# EAGLE design Relay-Board_Rack-PDU_1.0 (EAGLE 9.2.1)

## Sheet 1 of 3
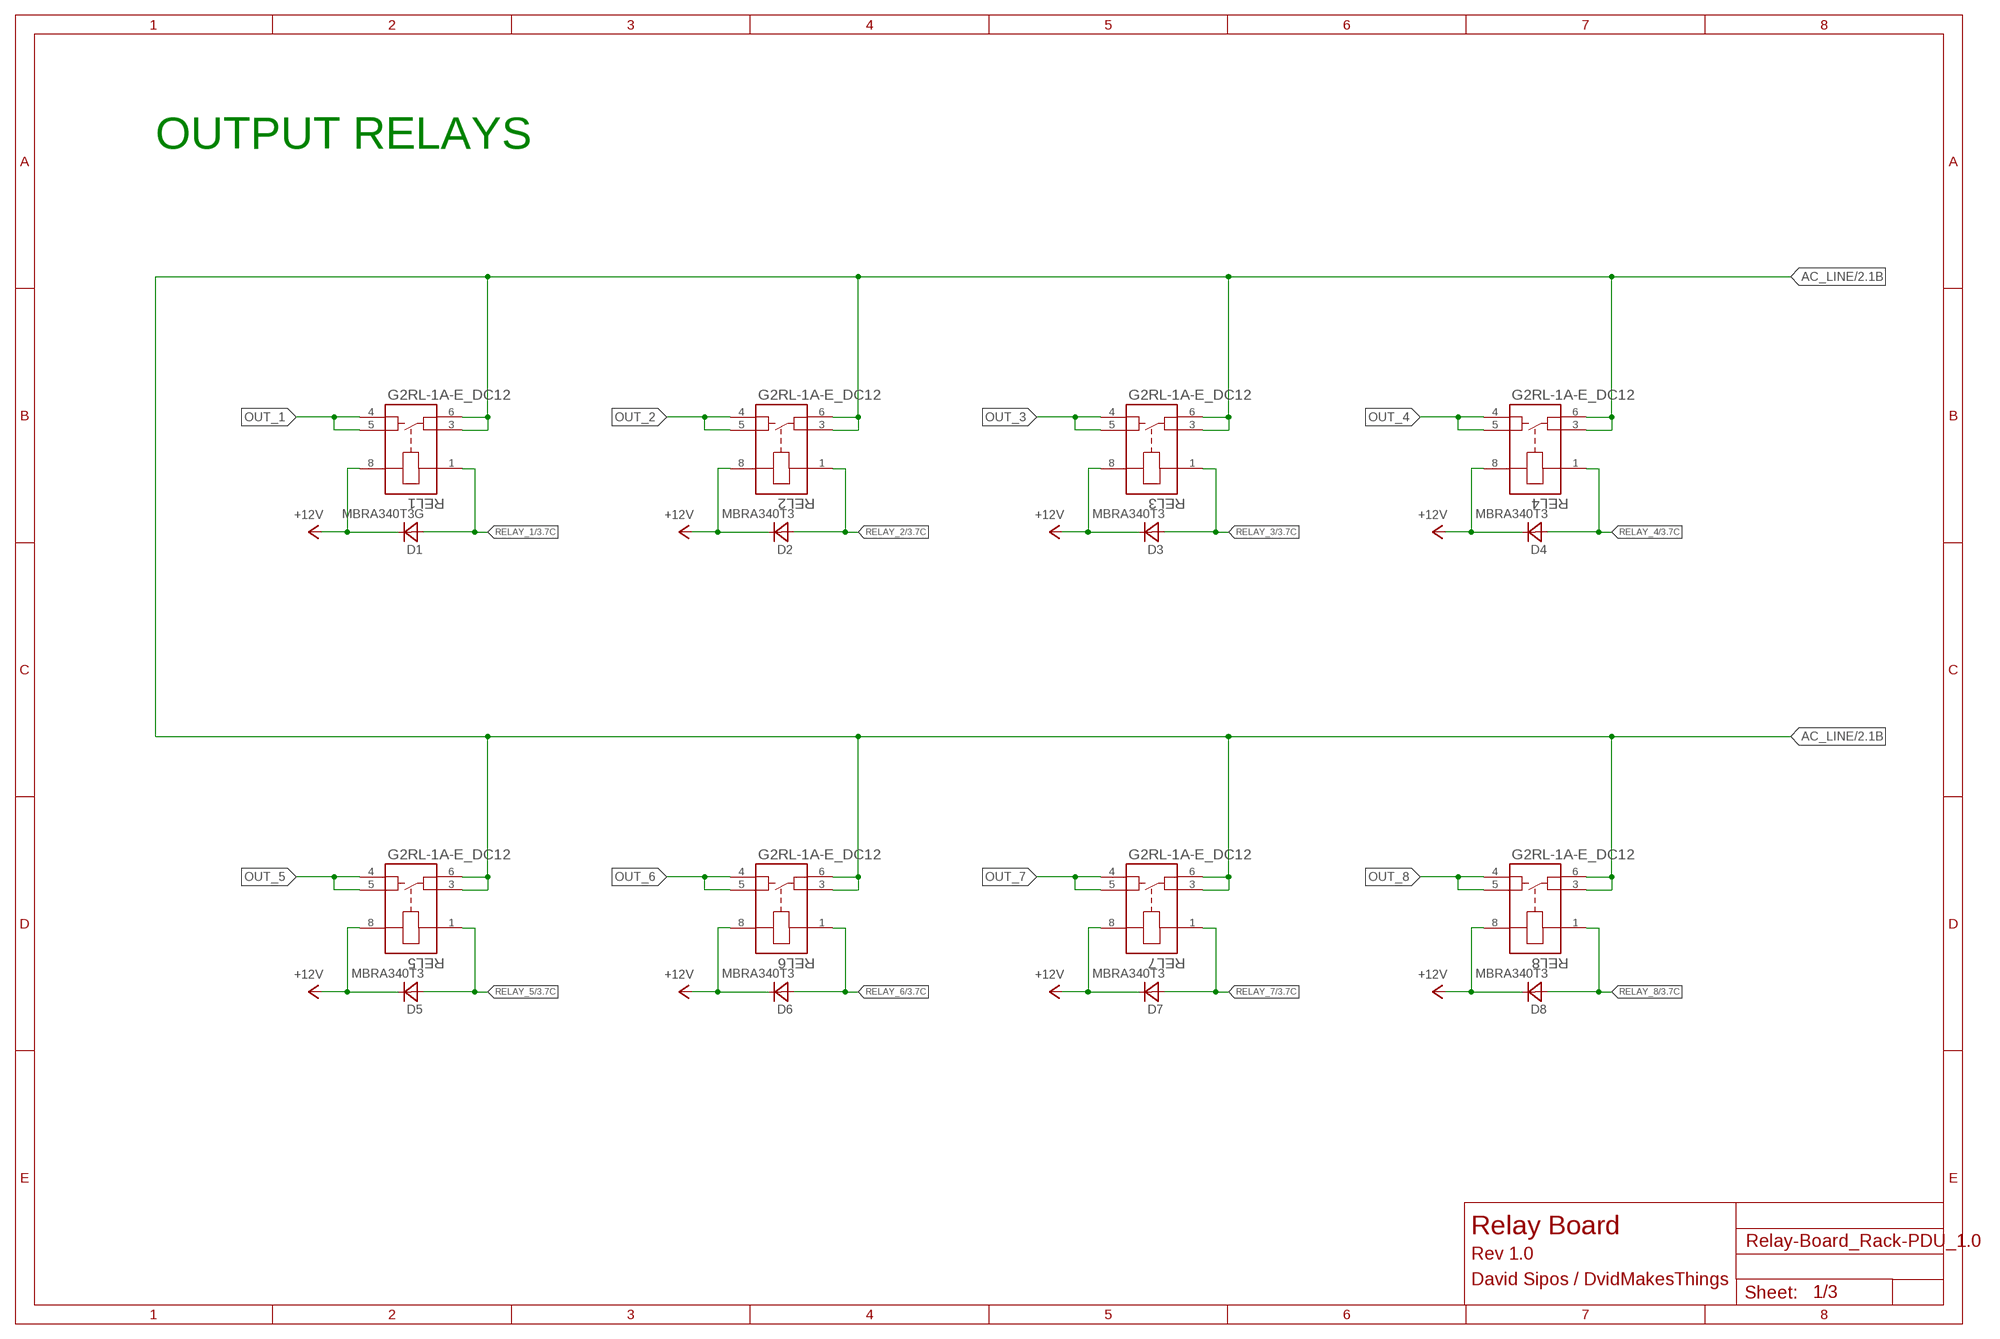
[diagram p0: schematic, sheet 1]

### Parts
D1  MBRA340T3G  MBRA340T3  [SMA]
D2  MBRA340T3  [SMA]
D3  MBRA340T3  [SMA]
D4  MBRA340T3  [SMA]
D5  MBRA340T3  [SMA]
D6  MBRA340T3  [SMA]
D7  MBRA340T3  [SMA]
D8  MBRA340T3  [SMA]
REL1  G2RL-1A-E_DC12  [RELAY_G2RL-1A-E_DC5_OMR]
REL2  G2RL-1A-E_DC12  [RELAY_G2RL-1A-E_DC5_OMR]
REL3  G2RL-1A-E_DC12  [RELAY_G2RL-1A-E_DC5_OMR]
REL4  G2RL-1A-E_DC12  [RELAY_G2RL-1A-E_DC5_OMR]
REL5  G2RL-1A-E_DC12  [RELAY_G2RL-1A-E_DC5_OMR]
REL6  G2RL-1A-E_DC12  [RELAY_G2RL-1A-E_DC5_OMR]
REL7  G2RL-1A-E_DC12  [RELAY_G2RL-1A-E_DC5_OMR]
REL8  G2RL-1A-E_DC12  [RELAY_G2RL-1A-E_DC5_OMR]

### Nets
+12V: D1.C D2.C D3.C D4.C D5.C D6.C D7.C D8.C REL1.8 REL2.8 REL3.8 REL4.8 REL5.8 REL6.8 REL7.8 REL8.8 ; also sheet 2,3
AC_LINE: REL1.3 REL1.6 REL2.3 REL2.6 REL3.3 REL3.6 REL4.3 REL4.6 REL5.3 REL5.6 REL6.3 REL6.6 REL7.3 REL7.6 REL8.3 REL8.6 ; also sheet 2
OUT_1: REL1.4 REL1.5
OUT_2: REL2.4 REL2.5
OUT_3: REL3.4 REL3.5
OUT_4: REL4.4 REL4.5
OUT_5: REL5.4 REL5.5
OUT_6: REL6.4 REL6.5
OUT_7: REL7.4 REL7.5
OUT_8: REL8.4 REL8.5
RELAY_1: D1.A REL1.1 ; also sheet 3
RELAY_2: D2.A REL2.1 ; also sheet 3
RELAY_3: D3.A REL3.1 ; also sheet 3
RELAY_4: D4.A REL4.1 ; also sheet 3
RELAY_5: D5.A REL5.1 ; also sheet 3
RELAY_6: D6.A REL6.1 ; also sheet 3
RELAY_7: D7.A REL7.1 ; also sheet 3
RELAY_8: D8.A REL8.1 ; also sheet 3

### Notes on the sheet
- OUTPUT RELAYS
- Relay Board
- Rev 1.0
- David Sipos / DvidMakesThings

## Sheet 2 of 3
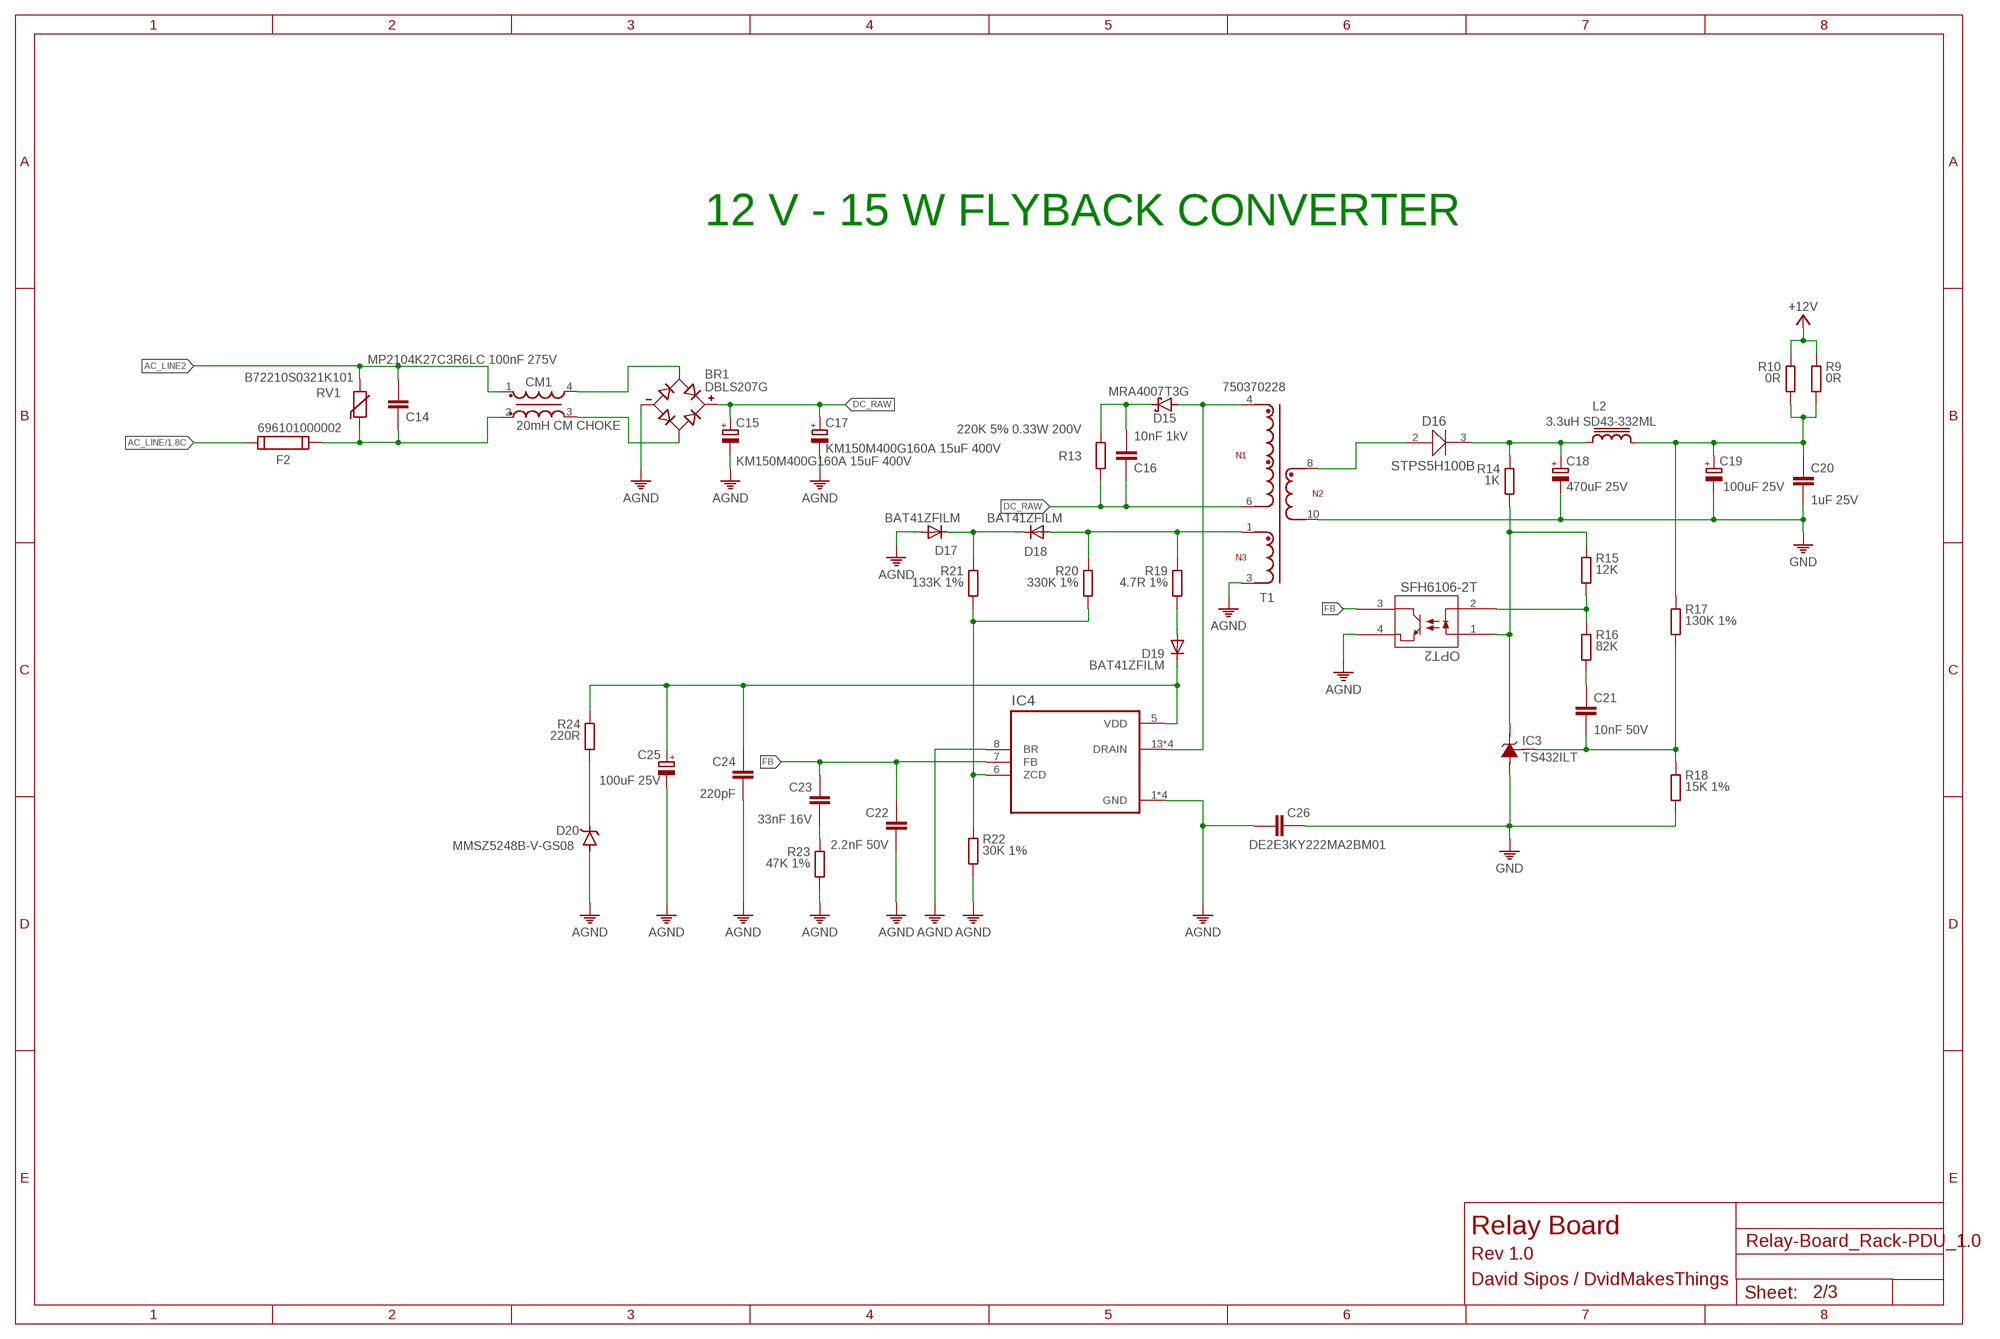
[diagram p1: schematic, sheet 2]

### Parts
BR1  DBLS207G  [DIOB_DBLS207G]
C14  MP2104K27C3R6LC 100nF 275V  C  [103-275V]
C15  KM150M400G160A 15uF 400V  C-POL_RADIAL-25MM-DIA  [CAPPRD550W110D1250H2500B]
C16  10nF 1kV  C-1206  [C1206]
C17  KM150M400G160A 15uF 400V  C-POL_RADIAL-25MM-DIA  [CAPPRD550W110D1250H2500B]
C18  470uF 25V  C-POL_RADIAL-11MM-DIA  [CAPPRD508W65D1000H1100B]
C19  100uF 25V  C-POL_RADIAL-11MM-DIA  [CAPPRD508W65D1000H1100B]
C20  1uF 25V  C-0805  [C0805]
C21  10nF 50V  C-0805  [C0805]
C22  2.2nF 50V  C-0603  [C0603]
C23  33nF 16V  C-0603  [C0603]
C24  220pF  C-0805  [C0805]
C25  100uF 25V  C-POL_RADIAL-11MM-DIA  [CAPPRD508W65D1000H1100B]
C26  DE2E3KY222MA2BM01  C102-1KV  [AR21AC103K4R]
CM1  20mH CM CHOKE  WE-CMB_XS_744821120  [WE-CMB_XS_744821120]
D15  MRA4007T3G  SS12  [SMA]
D16  STPS5H100B  [DPAK_STM]
D17  BAT41ZFILM  CGRM4001-G  [SOD-123_MINI-SMA]
D18  BAT41ZFILM  CGRM4001-G  [SOD-123_MINI-SMA]
D19  BAT41ZFILM  CGRM4001-G  [SOD-123_MINI-SMA]
D20  MMSZ5248B-V-GS08  BZG03C240-HM3-08  [DO214AC]
F2  696101000002  [696101000002]
IC3  TS432ILT  [SOT23]
IC4  VIPER35HD  [VIPER35HD]
L2  3.3uH SD43-332ML  INDUCTOR-BOURNS_SRN8040  [INDUCTOR-BOURNS_SRN8040]
OPT2  SFH6106-2T  SFH6106-3SMD-4_SFH610X_VIS-M  [SMD-4_SFH610X_VIS-M]
R9  0R  R0805  [0805]
R10  0R  R0805  [0805]
R13  220K 5% 0.33W 200V  R1206  [1206]
R14  1K  R0603  [0603]
R15  12K  R0603  [0603]
R16  82K  R0603  [0603]
R17  130K 1%  R0603  [0603]
R18  15K 1%  R0603  [0603]
R19  4.7R 1%  R0603  [0603]
R20  330K 1%  R0603  [0603]
R21  133K 1%  R0603  [0603]
R22  30K 1%  R0603  [0603]
R23  47K 1%  R0603  [0603]
R24  220R  R0805  [0805]
RV1  B72210S0321K101  WE-VD_10MM_820412001  [WE-VD_10MM_820412001]
T1  750370228  750370228  [WE-OLSTM_EE20_L22.2W25H16]

### Nets
+12V: R9.1 R10.1 ; also sheet 1,3
AC_LINE: F2.1 ; also sheet 1
AC_LINE2: C14.2 CM1.1 RV1.2
AGND: BR1.- C15.2(-) C17.2(-) C22.2 C24.2 C25.2(-) C26.1 D17.A D20.A IC4.1(GND) IC4.2(GND) IC4.3(GND) IC4.4(GND) IC4.8(BR) OPT2.4 R22.2 R23.2 T1.3
DC_RAW: BR1.+ C15.1(+) C16.1 C17.1(+) R13.2 T1.6
FB: C22.1 C23.1 IC4.7(FB) OPT2.3
GND: C18.2(-) C19.2(-) C20.2 C26.2 IC3.3 R18.2 T1.10 ; also sheet 3
N$2: C19.1(+) C20.1 L2.2 R9.2 R10.2 R17.1
N$5: BR1.AC1 CM1.4
N$12: BR1.AC2 CM1.3
N$20: C14.1 CM1.2 F2.2 RV1.1
N$22: C16.2 D15.C R13.1
N$23: D15.A IC4.13(DRAIN) IC4.14(DRAIN) IC4.15(DRAIN) IC4.16(DRAIN) T1.4
N$24: D16.2 T1.8
N$25: C18.1(+) D16.3 L2.1 R14.1
N$26: IC3.2 OPT2.1 R14.2 R15.1
N$27: OPT2.2 R15.2 R16.1
N$28: C21.1 R16.2
N$29: C21.2 IC3.1 R17.2 R18.1
N$30: C24.1 C25.1(+) D19.C IC4.5(VDD) R24.1
N$31: D19.A R19.2
N$32: D18.A R19.1 R20.1 T1.1
N$33: D17.C D18.C R21.1
N$34: IC4.6(ZCD) R20.2 R21.2 R22.1
N$35: C23.2 R23.1
N$36: D20.C R24.2

### Notes on the sheet
- 12 V - 15 W FLYBACK CONVERTER
- Relay Board
- Rev 1.0
- David Sipos / DvidMakesThings

## Sheet 3 of 3
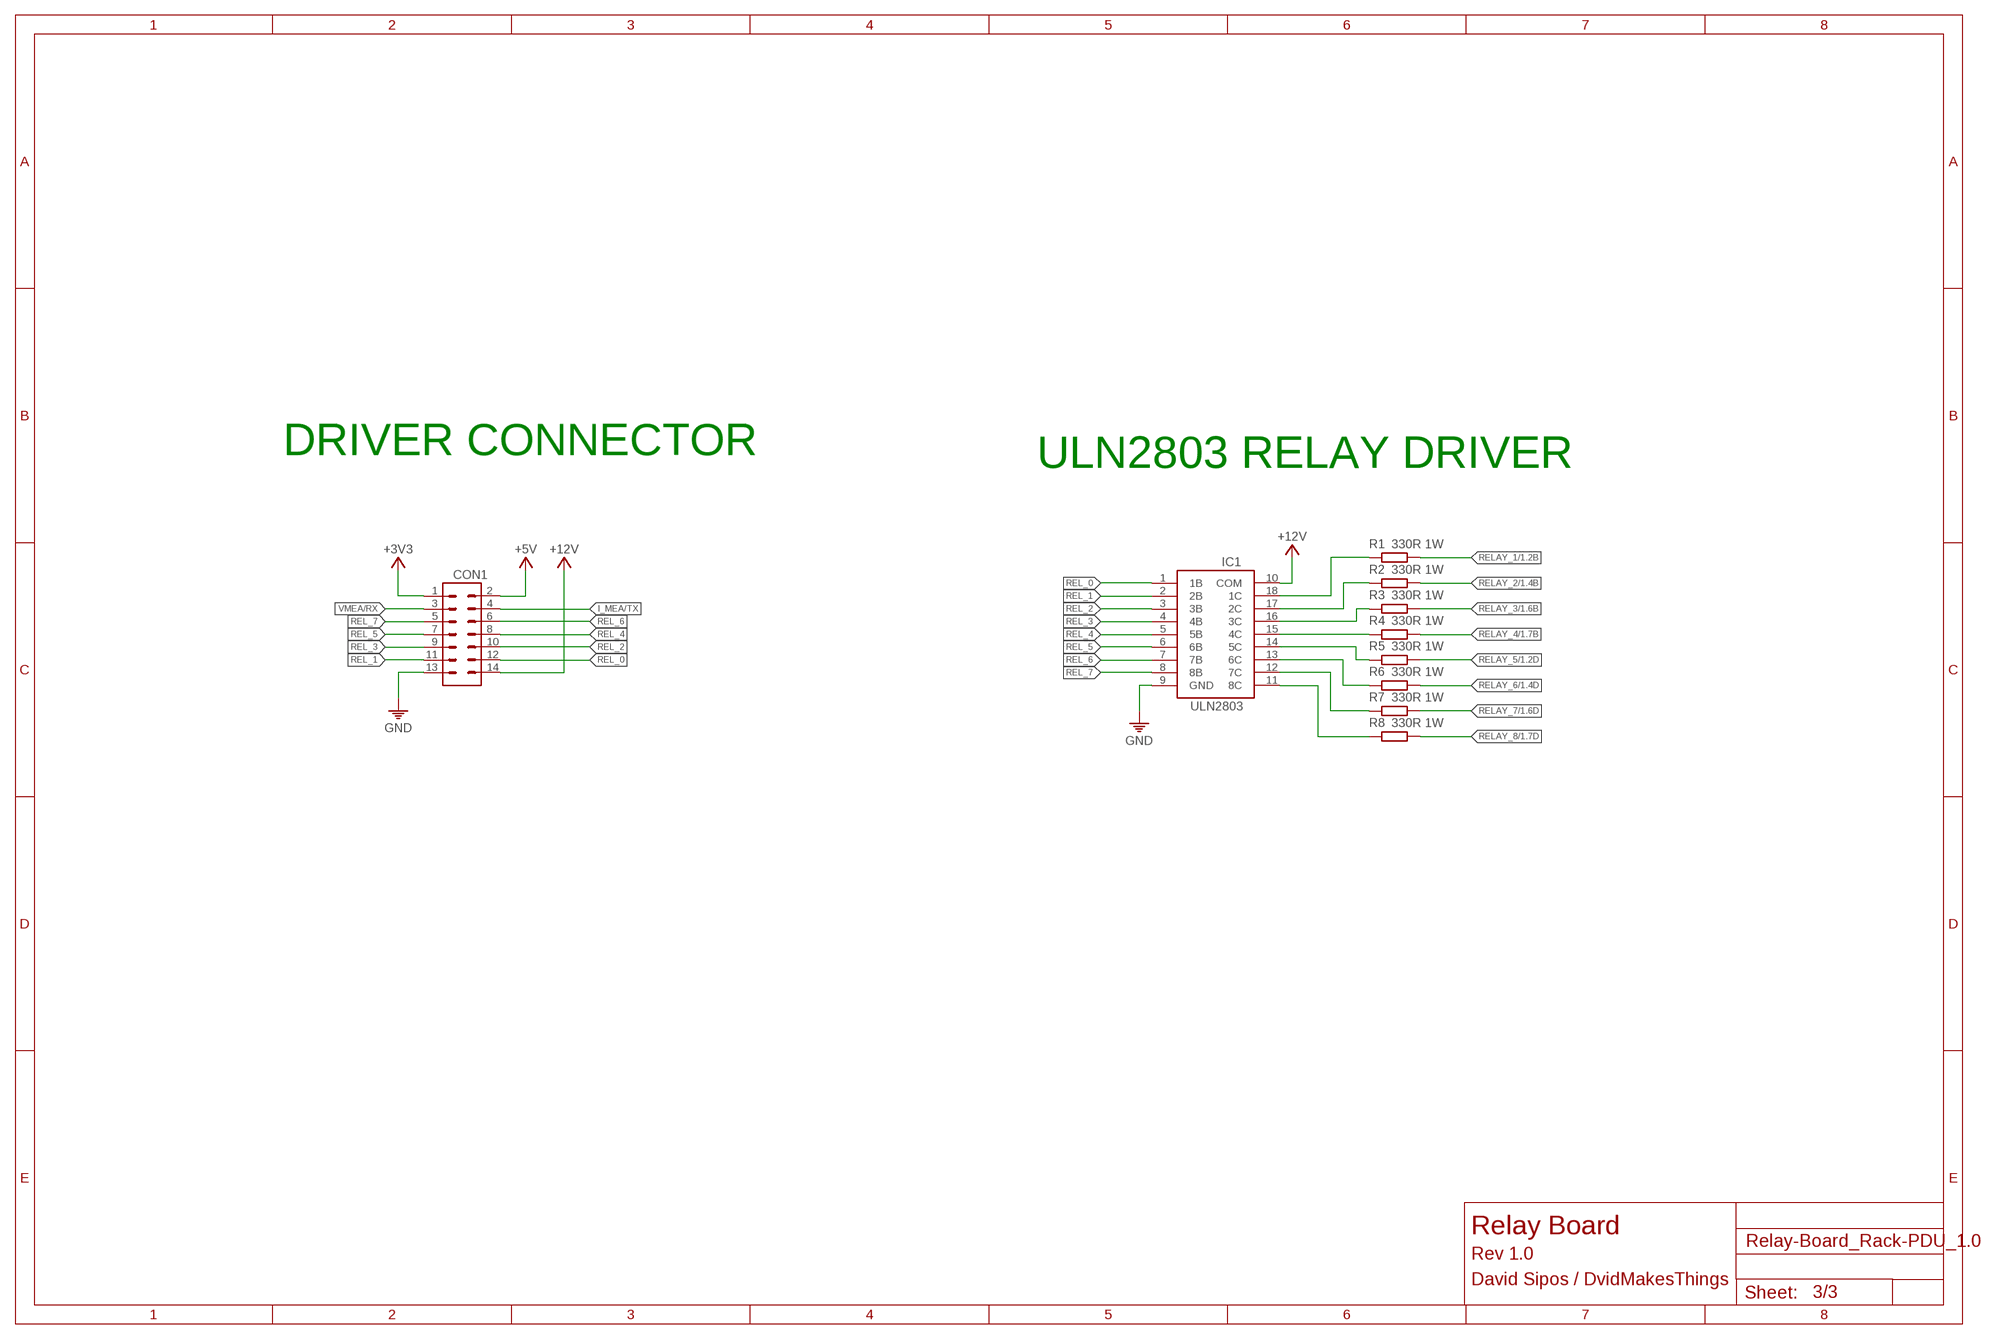
[diagram p2: schematic, sheet 3]

### Parts
CON1  CON-2X7  [2X7]
IC1  ULN2803A  ULN2803  [SO18]
R1  330R 1W  R1206  [1206]
R2  330R 1W  R1206  [1206]
R3  330R 1W  R1206  [1206]
R4  330R 1W  R1206  [1206]
R5  330R 1W  R1206  [1206]
R6  330R 1W  R1206  [1206]
R7  330R 1W  R1206  [1206]
R8  330R 1W  R1206  [1206]

### Nets
+3V3: CON1.1
+5V: CON1.2
+12V: CON1.14 IC1.10(COM) ; also sheet 1,2
GND: CON1.13 IC1.9(GND) ; also sheet 2
I_MEA/TX: CON1.4
N$6: IC1.18(1C) R1.1
N$7: IC1.17(2C) R2.1
N$8: IC1.16(3C) R3.1
N$9: IC1.15(4C) R4.1
N$10: IC1.14(5C) R5.1
N$11: IC1.13(6C) R6.1
N$13: IC1.12(7C) R7.1
N$15: IC1.11(8C) R8.1
REL_0: CON1.12 IC1.1(1B)
REL_1: CON1.11 IC1.2(2B)
REL_2: CON1.10 IC1.3(3B)
REL_3: CON1.9 IC1.4(4B)
REL_4: CON1.8 IC1.5(5B)
REL_5: CON1.7 IC1.6(6B)
REL_6: CON1.6 IC1.7(7B)
REL_7: CON1.5 IC1.8(8B)
RELAY_1: R1.2 ; also sheet 1
RELAY_2: R2.2 ; also sheet 1
RELAY_3: R3.2 ; also sheet 1
RELAY_4: R4.2 ; also sheet 1
RELAY_5: R5.2 ; also sheet 1
RELAY_6: R6.2 ; also sheet 1
RELAY_7: R7.2 ; also sheet 1
RELAY_8: R8.2 ; also sheet 1
VMEA/RX: CON1.3

### Notes on the sheet
- DRIVER CONNECTOR | ULN2803 RELAY DRIVER
- Relay Board
- Rev 1.0
- David Sipos / DvidMakesThings

## Library data of the parts
BR1 = ds_active:DBLS207G; MANUFACTURER: Taiwan Semiconductor; MAXIMUM_PACKAGE_HEIGHT: 2.93 mm; PARTREV: P2103; STANDARD: Manufacturer Recommendations
C14 C16 C20-C24 C26 = ds_passive:C
C15 C17 = Capacitor:C-POL: Capacitor Polarised - Generic; CATEGORY: Capacitor; PACKAGE_SIZE: 25MM-DIA; PACKAGE_TYPE: THT; SUBCATEGORY: Aluminum Electrolytic Capacitors; TYPE: Radial Can
C18 C19 C25 = Capacitor:C-POL: Capacitor Polarised - Generic; CATEGORY: Capacitor; PACKAGE_SIZE: 11MM-DIA; PACKAGE_TYPE: THT; SUBCATEGORY: Aluminum Electrolytic Capacitors; TYPE: Radial Can
CM1 = ds_trafo:WE-CMB_XS_744821120
CON1 = ds_con:CON-2X7
D1-D8 = diode:MBRA340T3: Surface Mount Schottky Power Rectifier Source: http://www.onsemi.com/pub_link/Collateral/MBRA340T3-D.PDF
D15 = Diodes:SS12: DIODE SCHOTTKY 20V 1A SMA Manufacturer's datasheet <https://www.onsemi.com/pub/Collateral/SS19-D.PDF>; CREATED_BY: PCBLayout.com; DIGIKEY_PART_NUMBER: SS12FSCT-ND; MANUFACTURER: ON Semiconductor; MPN: SS12; PACKAGE: SMA (DO-214AC)
D16 = ds_active:STPS5H100B; COPYRIGHT: Copyright (C) 2025 Ultra Librarian. All rights reserved.; MANUFACTURER_PART_NUMBER: STPS5H100B; MFR_NAME: STMicroelectronics
D17-D19 = diode:CGRM400*-G: Molded plasitc,JEDEC SOD-123/Mini SMA Source: Comchip CGRM4001-G.pdf
D20 = Diodes-2:BZG03C240-HM3-08: DIODE ZENER 240V 1.25W DO214AC Manufacturer's datasheet <https://www.vishay.com/docs/86138/bzg03c-m-series.pdf>; CREATED_BY: PCBLayout.om; DIGIKEY_PARTNO: BZG03C240-HM3-08GICT-ND; MANUFACTURER: Vishay General Semiconductor - Diodes Division; MPN: BZG03C240-HM3-08; PACKAGE: DO-214AC
F2 = Wurth_Connectors_WR-FSH:696101000002: WR-FSH Fuseholder THT Blocks PCB Clip Cover MATERIAL PROPERTIES Insulator Material PPO (PPE+PS) Insulator Flammability Rating UL94 V-1 Insulator Color Beige Contact Material Copper Alloy Contact Plating Tin over Nickel Contact Type Stamped GENERAL INFORMATION Operating Temperature -30 up to +120 °C Compliance RoHS ELECTRICAL PROPERTIES IR UL 18 A IR VDE 6.3 A Working Voltage [UL] 250 V (AC) Working Voltage [VDE] 250 V (AC) Withstanding Voltage [UL] 1500 V (AC) Withstanding Voltage [VDE] 1500 V (AC) Contact Resistance 10 mΩ MECHANICAL PROPERTIES Protection Class I & II Fuse Size 5x20 mm CERTIFICATION cULus Approval E157417 VDE Approval 129300 PACKAGING PROPERTIES Packaging Box <https://katalog.we-online.com/media/images/v2/o33101v209%20Family_WR-FSH_696101000002.jpg> Details see: https://katalog.we-online.com/en/em/FSH_THT_PCB_CLIP_COVER_696101000002 Updated by Ella Wu 2019-10-25 2019 (C) Wurth Elektronik; DATASHEET-URL: https://www.we-online.com/catalog/datasheet/696101000002.pdf; IR-UL: 18A; IR-VDE: 6.3A; MATES: 696120004001; PART-NUMBER: 696101000002
IC1 = ds_ic_peripherals:ULN2803: ULN2803A Darlington Transistor Arrays
IC3 = ds_ic_vreg:TS432ILT: 1.24 V adjustable shunt voltage reference
IC4 = ds_ic_peripherals:VIPER35HD: Quasi-resonant high performance off line high voltage converter
L2 = 52101-101-REV-A_v16:INDUCTOR-BOURNS_SRN8040: POWER INDUCTOR
OPT2 = ds_ic_peripherals:SFH6106-3; COPYRIGHT: Copyright (C) 2025 Ultra Librarian. All rights reserved.; MANUFACTURER_PART_NUMBER: SFH6106-3; MFR_NAME: Vishay; TYPE: Optoisolators
R1-R10 R13-R24 = ds_passive:R
REL1-REL8 = ds_passive:G2RL-1A-E_DC12; COPYRIGHT: Copyright (C) 2025 Ultra Librarian. All rights reserved.; MANUFACTURER_PART_NUMBER: G2RL-1A-E DC12; MFR_NAME: Omron
RV1 = Wurth_EMC Components_WE-VD:WE-VD_10MM: WE-VD Disk Varistor Characteristics Low clamping voltage After a surge impulse the varistor works immediately in normal mode so there is no slip current Excellent absorption at surge impulses Operating temperature: –40 ºC to +85 ºC for types up to 95 VRMS –40 ºC to +125 ºC for types from 115 VRMS Response time < 25 ns UL1449 4th Edition, CSA and VDE approved: - UL1449 File E332875 - CSA: File 224856 - VDE: File 40016986 and 40016998 - IEC: 60950-1: 2013 Annex Q from Ø 10 mm Applications 12–48 VDC distribution 110–400 V power supply Leakage of voltage peaks Surge protection in accordance with EN 61000-4-5 <https://katalog.we-online.com/media/images/v2/o14890v209%20WE-VD_Diskvaristoren_4C.jpg> Details see: https://katalog.we-online.com/en/pbs/WE-VD Updated by Ella Wu 2019-07-05 2019 (C) Wurth Elektronik; DATASHEET-URL: https://www.we-online.com/catalog/datasheet/820412001.pdf; ICLAMP: 5A; IPEAK: 1000A; MOUNT: THT; PART-NUMBER: 820412001; PDISS: 0.05W; VALUE: 20Vrms; VBR: 33V; VDC: 26Vdc; WMAX: 4.8J
T1 = ds_trafo:750370228: WE-OLSTM Offline Flyback Transformers Characteristics Nominal input voltage: 85–265 VAC (120–375 VDC) Operating temperature: –40 °C to +125 °C Isolation voltage: 2 kVAC up to 5 kVAC Multiple output options Options for fixed frequency or quasi-resonant mode operation Most products meet reinforced insulation Applications Offline-switch mode power supplies Especially designed for several ICs from STMicroelectronics Auxiliary power supply Home appliances Consumer electronics <https://www.we-online.com/components/media/o781306v209%20FAMILY-MID-OLSTM.jpg> Details see: www.we-online.com/en/components/products/WE-OLSTM <www.we-online.com/en/components/products/WE-OLSTM/?utm_source=eagle_model&utm_medium=description_link&utm_campaign=eisos_eagle> Created by Leviosa 2024-04-15 2024(C) Wurth Elektronik; DATASHEET-URL: https://www.we-online.com/redexpert/spec/750370228?ae; FSWITCH: 50 - 60kHz; IOUT1: 1250mA; ISAT: 1325mA; L: 1.5mH; MOUNT: THT; N: 8:1:1; PART-NUMBER: 750370228; SIZE: EE20/10/6; VAUX: 12V; VIN: 85 - 265 V (AC); VOUT1: 12V; VT: 3900V(AC)

## Board
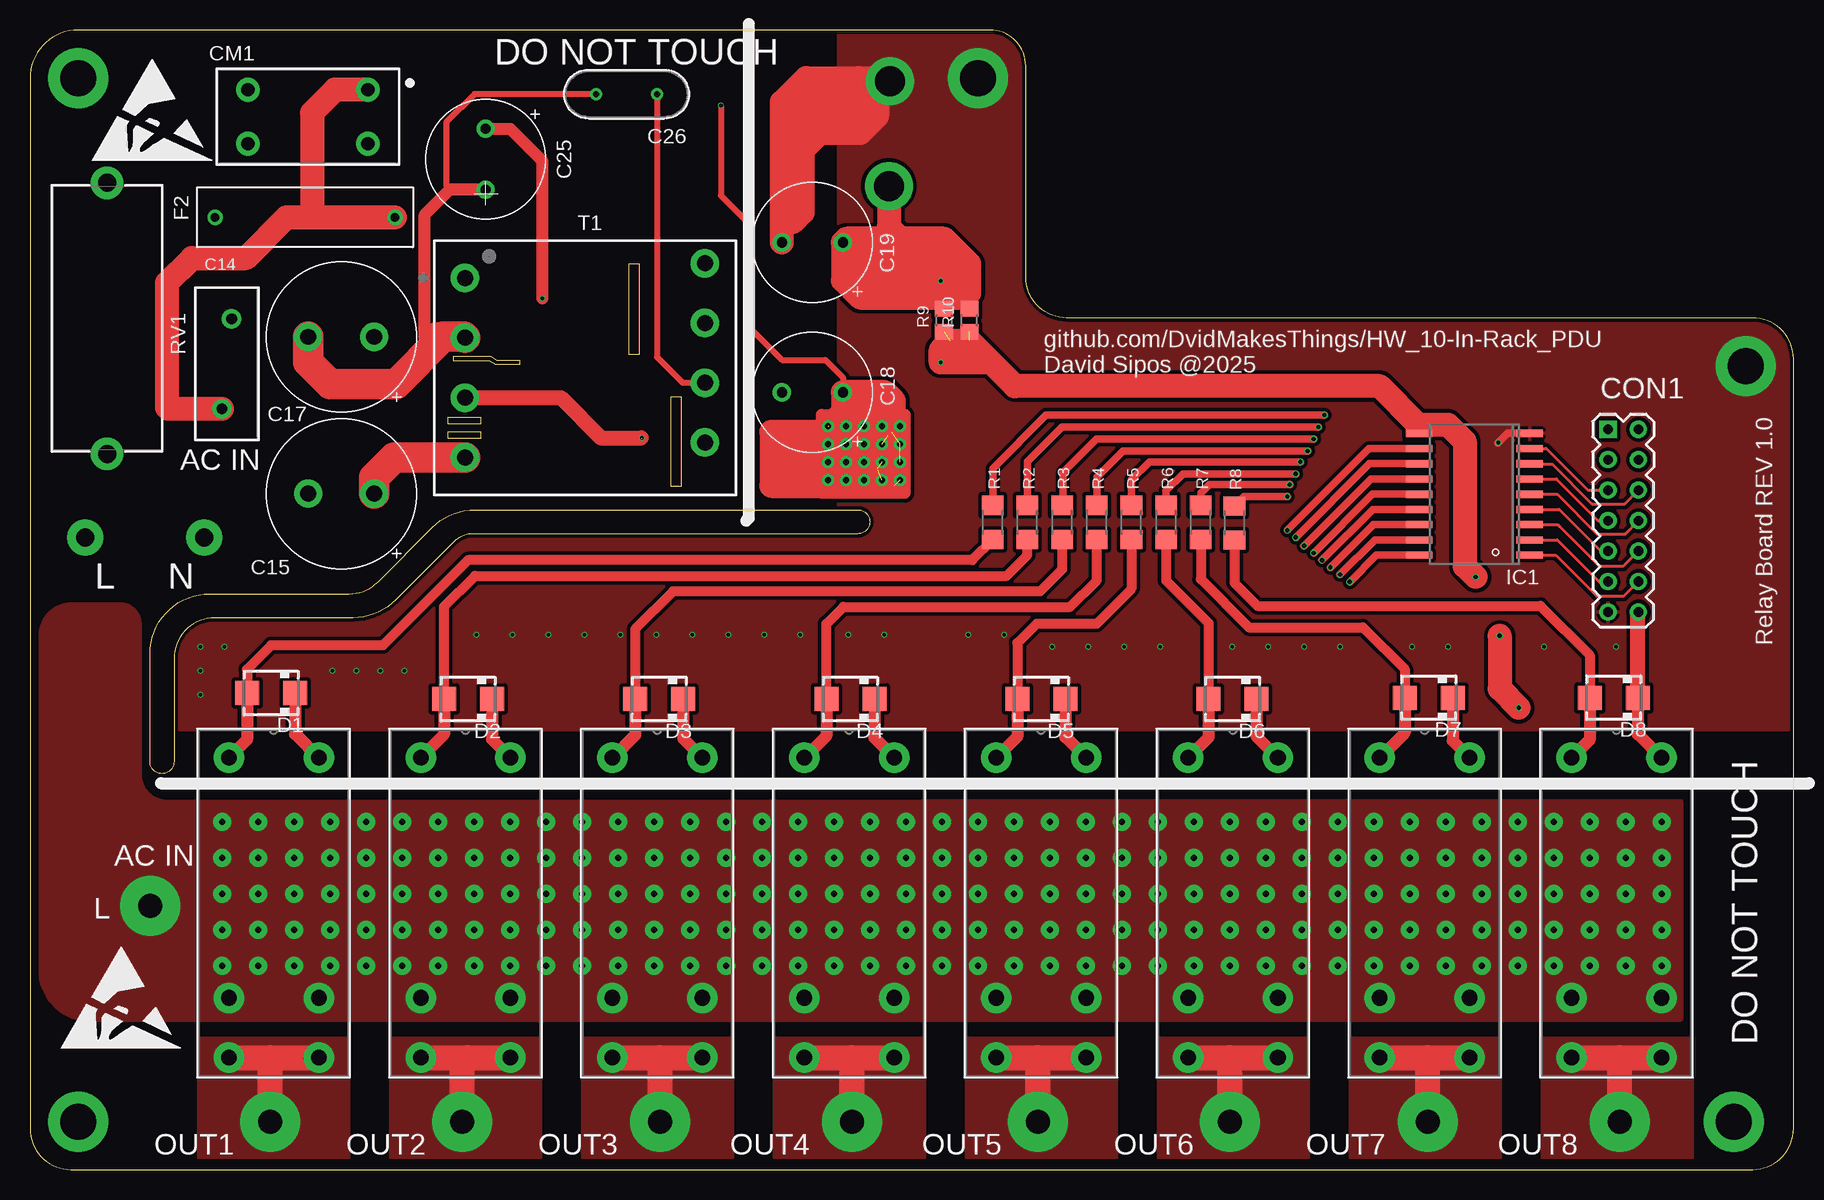
[diagram p3: board, top side]
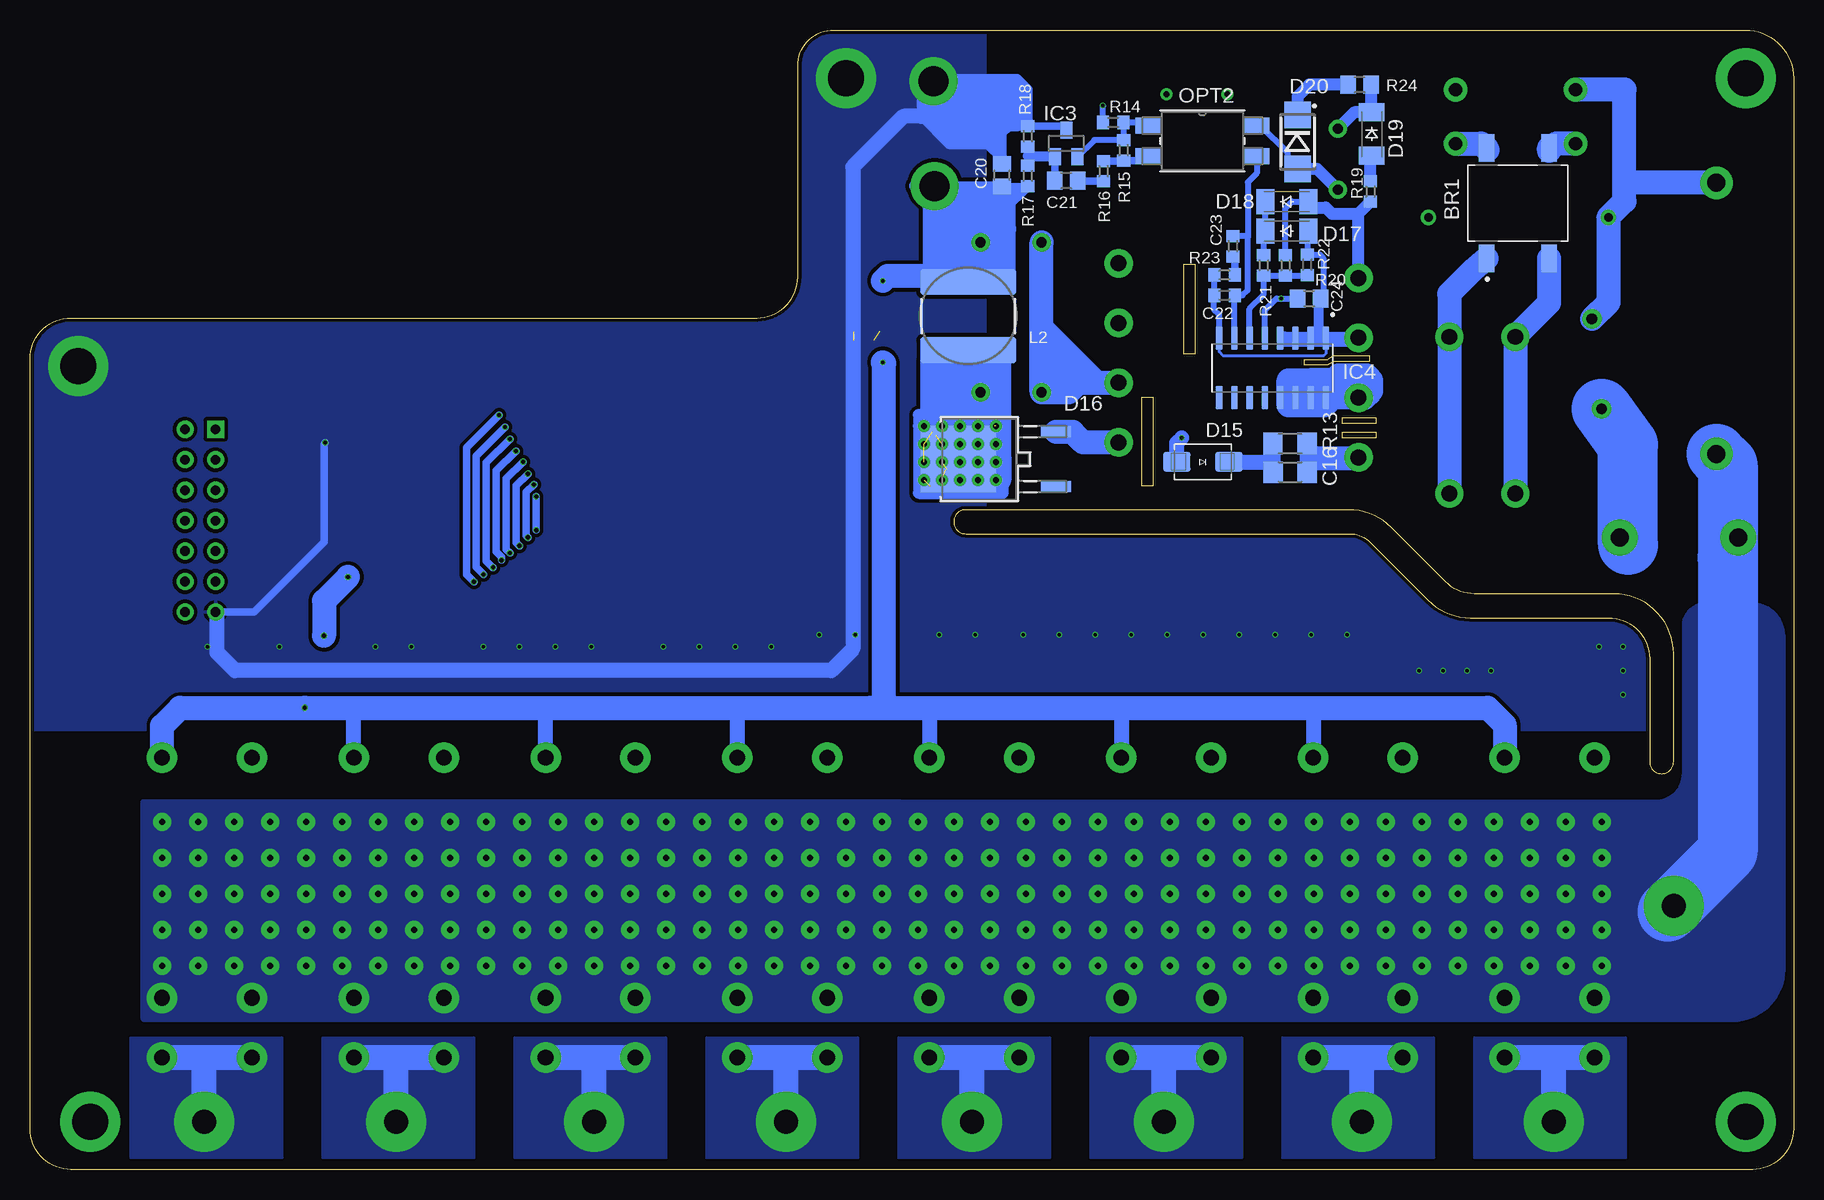
[diagram p4: board, bottom side, seen from below]

Size 147 x 95 mm. Coordinates in mm from the lower left corner, seen from the top.
Outline: 147,3.41 147,67.59 arc90 143.59,71 86.41,71 arc-90 83,74.41 83,92 arc90 80,95 4,95 arc90 0,91 0,3.41 arc90 3.41,0 143.59,0 arc90 147,3.41
Outline: 50.8,75.5 49.9,75.5 49.9,68 50.8,68 50.8,75.5
Outline: 53.4,64.4 53.4,57 54.3,57 54.3,64.4 53.4,64.4
Outline: 35.3,67.8 38.4,67.8 38.9,67.5 40.8,67.5 40.8,67.1 38.8,67.1 38.3,67.4 35.3,67.4 35.3,67.8
Outline: 37.6,61.5 34.8,61.5 34.8,61 37.6,61 37.6,61.5
Outline: 37.6,62.7 34.8,62.7 34.8,62.2 37.6,62.2 37.6,62.7
Outline: 10,34 10,43 arc-90 15,48 26.59,48 arc45 29,49 33.54,53.54 arc-45 37.07,55 69,55 arc-90 70,54 arc-90 69,53 37,53 arc45 35.29,52.29 30.46,47.46 arc-45 26.93,46 15.41,46 arc90 12,42.59 12,34 arc-90 11,33 arc-90 10,34
Copper layers (1*16): Top 0.035mm / dielectric 1.6mm / Bottom 0.035mm
Design rules "jlcpcb-2layers": minimum track width 5mil, minimum drill 0.3mm, track to track 5mil, track to pad 5mil, pad to pad 5mil, via to via 5mil, smd to smd 5mil, copper to edge 0.2mm, drill to drill 6mil, minimum pad ring 10mil, minimum via ring 3mil, stop-mask expansion 4mil, vias tented up to drill 0mil, thermal gap 10mil

### Footprints (pad centres in the part's own frame; a part is rotated, then mirrored left to right if it is on the bottom)
DIOB_DBLS207G = smd 2.3 x 1.3: + -4.6,2.6; - -4.6,-2.6; AC1 4.6,2.6; AC2 4.6,-2.6
103-275V = drill 0.7: 1 -7.5,0; 2 7.5,0
CAPPRD550W110D1250H2500B = drill 1.3 pad 1.95: 1 -2.75,0; 2 2.75,0
C1206 = smd 1.6 x 1.803: 1 -1.422,0; 2 1.422,0
CAPPRD508W65D1000H1100B = drill 0.85 pad 1.45: 1 -2.54,0; 2 2.54,0
C0805 = smd 1.3 x 1.5: 1 -0.95,0; 2 0.95,0
C0603 = smd 1 x 1.1: 1 -0.85,0; 2 0.85,0
AR21AC103K4R = drill 0.508 pad 1.016: 1 -2.54,0; 2 2.54,0
WE-CMB_XS_744821120 = drill 1.1: 1 -5,-2.25; 2 5,-2.25; 3 5,2.25; 4 -5,2.25
2X7 = drill 0.8 square: 1 -1.27,7.62 | drill 0.8: 2 1.27,7.62; 3 -1.27,5.08; 4 1.27,5.08; 5 -1.27,2.54; 6 1.27,2.54; 7 -1.27,0; 8 1.27,0; 9 -1.27,-2.54; 10 1.27,-2.54; 11 -1.27,-5.08; 12 1.27,-5.08; 13 -1.27,-7.62; 14 1.27,-7.62
SMA = smd 2 x 2: A 2,0; C -2,0
SMA' = smd 2.28 x 1.66: A 2.165,0; C -2.165,0
DPAK_STM = smd 0.94 x 2.489: 1 -2.286,-6.388; 2 2.286,-6.388 | smd 5.563 x 6.299: 3 0,1.765
SOD-123_MINI-SMA = smd 1.5 x 2.1: A 1.8,0; C -1.8,0
DO214AC = smd 2.2 x 2.21: A 2.25,0; C -2.25,0
696101000002 = drill 1.5: 1 -11.3,0; 2 11.3,0
SO18 = smd 0.6 x 2.2: 1 -5.08,-4.6; 2 -3.81,-4.6; 3 -2.54,-4.6; 4 -1.27,-4.6; 5 0,-4.6; 6 1.27,-4.6; 7 2.54,-4.6; 8 3.81,-4.6; 9 5.08,-4.6; 10 5.08,4.6; 11 3.81,4.6; 12 2.54,4.6; 13 1.27,4.6; 14 0,4.6; 15 -1.27,4.6; 16 -2.54,4.6; 17 -3.81,4.6; 18 -5.08,4.6
SOT23 = smd 1 x 1.4: 1 -0.95,-1.1; 2 0.95,-1.1; 3 0,1.1
VIPER35HD = smd 1.97 x 0.57: 1 -2.475,4.445; 2 -2.475,3.175; 3 -2.475,1.905; 4 -2.475,0.635; 5 -2.475,-0.635; 6 -2.475,-1.905; 7 -2.475,-3.175; 8 -2.475,-4.445; 9 2.475,-4.445; 10 2.475,-3.175; 11 2.475,-1.905; 12 2.475,-0.635; 13 2.475,0.635; 14 2.475,1.905; 15 2.475,3.175; 16 2.475,4.445
INDUCTOR-BOURNS_SRN8040 = smd 8 x 2.2: 1 0,2.85; 2 0,-2.85
SMD-4_SFH610X_VIS-M = smd 2.083 x 1.372: 1 -4.534,1.27; 2 -4.534,-1.27; 3 4.534,-1.27; 4 4.534,1.27
1206 = smd 1.6 x 1.803: 1 -1.422,0; 2 1.422,0
0805 = smd 1.3 x 1.5: 1 -0.95,0; 2 0.95,0
0603 = smd 1 x 1.1: 1 -0.85,0; 2 0.85,0
RELAY_G2RL-1A-E_DC5_OMR = drill 1.295 pad 2.54: 1 -3.683,12.776; 3 -3.683,-7.239; 4 -3.683,-12.217; 5 3.81,-12.217; 6 3.81,-7.239; 8 3.81,12.776
WE-VD_10MM_820412001 = drill 0.9: 1 -3.75,0.4; 2 3.75,-0.4
WE-OLSTM_EE20_L22.2W25H16 = drill 1.32 pad 1.93: 1 -10,7.48; 3 -10,2.5; 4 -10,-2.5; 6 -10,-7.48; 8 10,-6.225; 10 10,-1.245; 12 10,3.735; 14 10,8.715

### Placement (x,y rotation side)
BR1  22.98,80.57 90 bottom
C14  22.93,79.38 0 top
C15  25.94,56.35 180 top
C16  41.96,58.13 180 bottom
C17  25.94,69.42 180 top
C18  65.22,64.8 180 top
C19  65.22,77.3 180 top
C20  65.97,82.9 90 bottom
C21  60.62,82.43 180 bottom
C22  47.43,72.88 180 bottom
C23  46.73,76.97 270 bottom
C24  40.37,72.61 0 bottom
C25  37.98,84.23 270 top
C26  49.72,89.65 0 top
CM1  23.17,87.78 180 top
CON1  132.8,54.1 0 top
D1  20.09,39.72 180 top
D2  36.52,39.22 180 top
D3  52.45,39.22 180 top
D4  68.38,39.22 180 top
D5  84.31,39.22 180 top
D6  100.24,39.22 180 top
D7  116.59,39.33 180 top
D8  132.02,39.33 180 top
D15  MRA4007T3G  [SMA']  49.24,59 180 bottom
D16  67.86,59.22 90 bottom
D17  42.23,78.24 0 bottom
D18  42.23,80.69 0 bottom
D19  35.16,86.33 270 bottom
D20  41.35,85.67 270 bottom
F2  6.42,70.96 90 top
IC1  120.4,56.3 90 top
IC3  60.62,85.54 0 bottom
IC4  43.43,66.83 270 bottom
L2  68.8,71.15 180 bottom
OPT2  49.27,85.75 0 bottom
R1  80.25,53.95 270 top
R2  83.14,53.95 270 top
R3  86.03,53.95 270 top
R4  88.92,53.95 270 top
R5  91.81,53.95 270 top
R6  94.7,53.95 270 top
R7  97.59,53.95 270 top
R8  100.4,53.9 270 top
R9  76.2,70.8 90 top
R10  78.3,70.8 90 top
R13  41.97,60.52 0 bottom
R14  56.71,87.29 0 bottom
R15  55.84,84.97 270 bottom
R16  57.51,83.23 270 bottom
R17  63.83,82.83 90 bottom
R18  63.83,86.14 90 bottom
R19  35.26,81.53 90 bottom
R20  42.35,75.37 270 bottom
R21  44.16,75.37 270 bottom
R22  40.53,75.43 90 bottom
R23  47.43,74.58 180 bottom
R24  36.16,90.44 180 bottom
REL1  20.26,21.55 0 top
REL2  36.25,21.55 0 top
REL3  52.24,21.55 0 top
REL4  68.23,21.55 0 top
REL5  84.22,21.55 0 top
REL6  100.21,21.55 0 top
REL7  116.2,21.55 0 top
REL8  132.19,21.55 0 top
RV1  16.4,67.17 270 top
T1  46.27,66.84 0 top
U$1  [ESD_10.00]  2.5,10 0 top
U$2  [ESD_10.00]  5.1,84 0 top

### Tracks (layer width: path | path; a pad name or v marks a point on that pad's centre or on a via)
+12V  (via drill 0.3, 0.35)  (2 unrouted)
  Top 0.61: 118.75,61.84 116.27,61.84 IC1.10 115.8,62 115.7,62.1
  Top 1.016: D1.C 22.09,36.31 REL1.8 | D2.C 38.52,35.87 REL2.8 | D3.C 54.45,35.93 REL3.8 | D4.C 70.38,35.99 REL4.8 | D5.C 86.31,36.05 REL5.8 | D6.C 102.24,36.11 REL6.8 | D7.C 118.59,35.75 REL7.8 | D8.C 134.02,36.31 REL8.8
  Top 1.27: D8.C 134.02,46.43 CON1.14
  Top 2: v120.5,49.4 119.6,50.3 119.6,60.7 118.2,62.1 115.7,62.1 112.5,65.3 82.1,65.3 78.3,69.1 76.7,69.1 75.9,68.3 v75.9,67.3 79.7,67.3 79.9,67.5 | v122.5,44.5 122.5,40.1 v124.1,38.5
  Bottom 1.27: 25.5,38.5 40,38.5 | 40,38.5 56,38.5 | 56,38.5 72,38.5 | 72,38.5 75,38.5 | 76.9,38.5 88,38.5 | 88,38.5 104,38.5 | 104,38.5 120,38.5 | 120,38.5 v124.1,38.5 133.5,38.5 | REL7.8 120.01,38.49 120,38.5 | REL6.8 104.02,38.48 104,38.5 | REL5.8 88.03,38.47 88,38.5 | REL4.8 72,34.37 72,38.5 | REL3.8 56,34.38 56,38.5 | REL2.8 40,34.39 40,38.5
  Bottom 2: REL8.8 136,37 134.5,38.5 v124.1,38.5 76.9,38.5 75.8,38.5 | 75.8,38.5 75,38.5 25.5,38.5 24.07,37.07 REL1.8 | v120.5,49.4 122.5,47.4 v122.5,44.5 | 75.8,38.5 75.8,67.2 v75.9,67.3
AC_LINE  (via drill 0.5 pad 1.5, 1.5 pad 3, 2 pad 5)
  Bottom 2: 5.5,52.73 5.5,51
  Bottom 2.54: v4.6,52.7 4.6,52.5 5.5,52.5 | 6.1,52.5 5.5,52.5 | 5.5,52.5 5.5,51
  Bottom 5: 10.5,21.5 v10,22 5.5,26.5 5.5,51 5.5,58.74 F2.1
  other vias: 16,29 19,29 22,29 25,29 28,29 31,29 34,29 37,29 40,29 43,29 46,29 49,29 52,29 55,29 58,29 61,29 64,29 67,29 70,29 73,29 76,29 79,29 82,29 85,29 88,29 91,29 94,29 97,29 100,29 103,29 109,29 106,29 112,29 115,29 121,29 118,29 124,29 127,29 130,29 133,29 136,29 16,26 19,26 22,26 25,26 28,26 31,26 34,26 37,26 40,26 43,26 46,26 49,26 52,26 55,26 58,26 61,26 64,26 67,26 70,26 73,26 76,26 79,26 82,26 85,26 88,26 91,26 94,26 97,26 100,26 103,26 109,26 106,26 112,26 115,26 121,26 118,26 124,26 127,26 130,26 133,26 136,26 16,23 19,23 22,23 25,23 28,23 31,23 34,23 37,23 40,23 43,23 46,23 49,23 52,23 55,23 58,23 61,23 64,23 67,23 70,23 73,23 76,23 79,23 82,23 85,23 88,23 91,23 94,23 97,23 100,23 103,23 109,23 106,23 112,23 115,23 121,23 118,23 124,23 127,23 130,23 133,23 136,23 16,20 19,20 22,20 25,20 28,20 31,20 34,20 37,20 40,20 43,20 46,20 49,20 52,20 55,20 58,20 61,20 64,20 67,20 70,20 73,20 76,20 79,20 82,20 85,20 88,20 91,20 94,20 97,20 100,20 103,20 109,20 106,20 112,20 115,20 121,20 118,20 124,20 127,20 130,20 133,20 136,20 16,17 19,17 22,17 25,17 28,17 31,17 34,17 37,17 40,17 43,17 46,17 49,17 52,17 55,17 58,17 61,17 64,17 67,17 70,17 73,17 76,17 79,17 82,17 85,17 88,17 91,17 94,17 97,17 100,17 103,17 109,17 106,17 112,17 115,17 121,17 118,17 124,17 127,17 130,17 133,17 136,17
  pour Top (no thermals): 137.5,12.6 5.04,12.6 arc-90 1,16.64 1,44.5 arc-90 3.5,47 7.5,47 arc-90 9,45.5 9,33 arc90 11.5,30.5 137.5,30.6
  pour Bottom (no thermals): 137.5,12.6 5.07,12.6 arc-90 1,16.67 1,44.5 arc-90 3.5,47 7.29,47 arc-90 9,45.29 9,33 arc90 11.5,30.5 137.5,30.6
AC_LINE2  (via drill 1.5 pad 3)
  Top 2: 23.5,79.38 21.38,79.38 18,76 13.5,76 11.4,73.9 11.4,63.54 11.52,63.42 RV1.2 | 23.5,79.38 C14.2 | CM1.1 25.43,90.03 23.5,88.1 23.5,79.38
  Bottom 2: 13.8,52.1 14.43,52.73
  Bottom 2.54: v14.5,52.7 14.5,52.1 13.8,52.1
  Bottom 5: 13.8,52.1 13.8,60.44 RV1.2
AGND
  Top 0.508: C26.1 37.05,89.65 34.7,87.3 34.7,81.98 34.99,81.69
  Top 1.016: C25.2 34.99,81.69 32.9,79.6 32.9,69.34 33.84,69.34
  Top 2.54: T1.3 36.17,69.44 34.44,69.44 34.34,69.34 | 34.34,69.34 33.84,69.34 | C17.2 23.19,67.31 25,65.5 30.5,65.5 34.34,69.34
  Bottom 0.254: IC4.4 42.52,69.31 | 42.52,69.31 42.46,69.24 | 42.52,69.31 IC4.3 IC4.2 | 39.6,69.24 39.05,69.24 IC4.1 38.98,68.02 39.17,67.83 47.53,67.83 47.88,68.17 IC4.8
  Bottom 0.508: IC4.8 47.88,71.28 48.3,71.7 48.3,72.86 C22.2 R23.2 | D17.A 40.53,78.14 R22.2 39.48,76.28 39.2,76 39.2,72.83 C24.2 | OPT2.4 44.42,87.02 42.2,84.8 42.2,84.1 41.52,83.42 D20.A
  Bottom 0.813: C24.2 39.6,72.43 39.6,69.24
  Bottom 1.016: D20.A 39.71,83.42 C25.2
  Bottom 1.27: 42.46,69.24 39.6,69.24 36.37,69.24
  Bottom 2: BR1.- 20.38,72.23 C17.2 C15.2 | T1.3 36.37,69.24
DC_RAW
  Top 2.54: T1.6 30.36,59.36 28.69,57.69 C15.1
  Bottom 1.27: R13.2 40.55,59.2 | 40.55,59.2 C16.1 | 40.55,59.2 40.1,59.2 40,59.3
  Bottom 2: BR1.+ 26.72,74.98 28.69,73.01 C17.1 C15.1 | 40,59.3 36.33,59.3 T1.6
FB
  Bottom 0.508: IC4.7 46.6,72.86 C22.1 45.92,72.88 45.5,73.3 45.5,77.7 | C23.1 45.62,77.82 45.5,77.7 | OPT2.3 44.74,83.06 45.5,82.3 45.5,77.7
GND  (via drill 0.3, 0.3 pad 0.4, 0.35, 2.5 pad 4, 3 pad 5)
  Top 0.508: C26.2 52.26,67.74 54.41,65.59 T1.10
  Top 0.61: 122.34,60.55 v122.4,60.6 123.18,61.38 IC1.9
  Top 2: C19.2 62.68,88.98 64.7,91 70.2,91 70.2,90.8 70.6,90.4 70.6,87.8 69.2,86.4 65.8,86.4 64.4,85 64.4,79.8 63.6,79 63.1,79 63.1,86.4 63.1,87.1 65.6,89.6 67.7,89.6 69.1,91 71.4,91 v71.69,90.71
  Top 2.54: 63.1,86.4 64.1,86.4 66.1,88.4 68.8,88.4 69,88.2 69.2,88.4 69.2,89.2
  Bottom 0.61: IC3.3 60.97,86.99 R18.2 | 65.97,84.3 C20.2 | v122.4,60.6 122.5,60.5 122.5,52.3 128.32,46.48 131.4,46.48 CON1.13
  Bottom 0.813: R18.2 63.83,90.03 64.7,90.9 72.1,90.9 72.7,90.3 72.7,87.8 70.4,85.5 67.17,85.5 65.97,84.3 | C20.2 65.97,86.43 65.4,87 64.6,87 64.6,89.8 64.8,90 68.1,90 68.3,90.2 | 68.5,90.4 68.3,90.2 | 68.3,90.2 64.9,90.2
  Bottom 1.27: 72.7,87.8 74.2,87.8 78.4,83.6 78.4,43.4 80.2,41.6 129.9,41.6 131.4,43.1 131.4,46.48
  Bottom 2: 59.6,65.59 58.1,65.59 | 58.1,65.59 T1.10 | 59.6,65.59 60.4,64.8 C18.2 62.68,70.17 | 62.68,70.17 C19.2 | 58.1,65.59 62.68,70.17 | 59.6,65.59 61.41,67.4 61.7,67.4 61.7,66.3 61.2,65.8 | 64.9,90.2 65.2,89.9 65.2,87.7 69.3,87.7 69.3,86.7 69.5,86.5 69.8,86.8 | 69.8,86.8 70.3,86.8 | 69.8,86.8 67.4,86.8 70.3,89.7 71.5,89.7 71.9,89.3 71.9,90.5 v71.69,90.71
  Bottom 2.54: v71.69,90.71 70.28,89.3 67.1,89.3 68.3,88.1 | 68.3,88.1 71.2,88.1 | 68.3,88.1 68,88.1 66.9,87 66.9,86.3
  other vias: 143,67 79,91 14.2,43.6 14.2,41.6 25.2,41.6 27.2,41.6 29.2,41.6 31.2,41.6 14.2,39.6 16.2,43.6 37.2,44.6 40.2,44.6 43.2,44.6 46.2,44.6 49.2,44.6 52.2,44.6 55.2,44.6 58.2,44.6 61.2,44.6 64.2,44.6 68.2,44.6 71.2,44.6 78.2,44.6 81.2,44.6 85.2,43.6 88.2,43.6 91.2,43.6 94.2,43.6 100.2,43.6 103.2,43.6 106.2,43.6 109.2,43.6 115.2,43.6 118.2,43.6 126.2,43.6 132.2,43.6
  pour Top (isolate 0.305): 67.4,97 85.8,97 85.8,74 148.4,74 148.4,36.7 11.4,36.7 11.4,44.6 13.7,46.9 28.5,46.9 35.5,53.9 67.4,53.9
  pour Bottom (isolate 0.305): 67.9,97 85.8,97 85.8,74 148.4,74 148.4,36.7 11.4,36.7 11.4,44.3 11.4,44.6 13.7,46.9 28.5,46.9 35.5,53.9 67.4,53.9 67.4,97
N$1  (via drill 3 pad 5)
  other vias: 142,4
N$2  (via drill 0.3, 2.5 pad 4)
  Top 1.016: R10.2 77.9,72.15 77.9,72.7 | R9.2 76.3,71.85 76.3,72.7
  Top 2: 72.56,77.6 68.06,77.6 C19.1 67.76,74.14 69.2,72.7 76.3,72.7 | v71.59,81.99 71.59,78.57 72.56,77.6 | v75.9,74.1 76.3,73.7 | 76.3,73.7 76.3,72.7 | 76.3,72.7 77.9,72.7 78.3,73.1 78.3,75.5 76.2,77.6 72.56,77.6 | 76.3,73.7 76.3,75.9 76,76.2 69.2,76.2 68.8,75.8 68.8,74.3 69,74.1 75,74.1 75.1,74.2 74.9,74.4 74.9,74.9 70.4,74.9
  Bottom 0.61: R17.1 63.86,81.95 C20.1 65.97,81.4 65.97,81.3 65.97,79.09 C19.1
  Bottom 0.813: 65.97,81.4 64.41,81.4 R17.1 65.8,80.01 65.8,78.4
  Bottom 1.27: 73.09,81.99 v71.59,81.99
  Bottom 2: L2.2 68.3,74.5 | 68.3,74.5 65.8,74.5 65.8,78.4 65.8,81.13 65.97,81.3 | 65.97,81.4 71,81.4 v71.59,81.99 71.59,74.91 | 71.59,74.91 71.7,74.8 | 71.59,74.91 70.1,76.4 | 70.1,76.4 70.1,80.4 | 70.1,76.4 70.1,74.7 69.9,74.5 68.7,75.7 68.7,80 67.3,80 67.2,79.9 67.2,76.2 67.6,75.8 | 68.3,74.5 75.5,74.5 v75.9,74.1
N$3  (via drill 3 pad 5)
  other vias: 4,4
N$4  (via drill 3 pad 5)
  other vias: 4,91
N$5
  Bottom 2: CM1.4 26.03,85.53 25.48,84.98 BR1.AC1
N$6  (via drill 0.35)
  Top 0.61: R1.1 80.25,58.45 84.7,62.9 v107.9,62.9 | IC1.18 112.22,51.22 v110,49
  Bottom 0.61: v110,49 110.6,49.6 110.6,60.2 v107.9,62.9
N$7  (via drill 0.35)
  Top 0.61: R2.1 83.14,59.04 86,61.9 v107.4,61.9 | IC1.17 112.09,52.49 v109.2,49.6
  Bottom 0.61: v109.2,49.6 109.2,49.62 109.82,50.24 109.82,59.48 v107.4,61.9
N$8  (via drill 0.35)
  Top 0.61: v107,60.9 88.9,60.9 86.1,58.1 86.1,55.44 R3.1 | IC1.16 111.96,53.76 v108.4,50.2
  Bottom 0.61: v108.4,50.2 108.44,50.2 108.98,50.74 108.98,58.92 v107,60.9
N$9  (via drill 0.35)
  Top 0.61: v106.5,59.9 91.1,59.9 88.92,57.72 R4.1 | IC1.15 111.93,55.03 v107.7,50.8
  Bottom 0.61: v107.7,50.8 107.7,51.06 108.15,51.51 108.15,58.25 v106.5,59.9
N$10  (via drill 0.35)
  Top 0.61: v105.9,59 93.3,59 91.81,57.51 R5.1 | IC1.14 111.9,56.3 v107,51.4
  Bottom 0.61: v107,51.4 107.3,51.7 107.3,52.42 107.31,52.43 107.31,57.59 v105.9,59
N$11  (via drill 0.35)
  Top 0.61: v105.5,58 96.1,58 94.7,56.6 R6.1 | IC1.13 111.77,57.57 v106.2,52
  Bottom 0.61: v106.2,52 106.47,52.27 106.47,57.03 v105.5,58
N$12
  Bottom 2: CM1.3 19.77,85.53 20.38,84.92 BR1.AC2
N$13  (via drill 0.35)
  Top 0.61: R7.1 97.59,56.39 98.3,57.1 v105,57.1 | IC1.12 111.64,58.84 v105.5,52.7
  Bottom 0.61: v105.5,52.7 105.64,52.84 105.64,56.46 v105,57.1
N$15  (via drill 0.35)
  Top 0.61: R8.1 101.18,56.1 v104.8,56.1 | IC1.11 111.61,60.11 v104.8,53.3
  Bottom 0.61: v104.8,53.3 v104.8,56.1
N$20
  Bottom 2: F2.2 14.1,82.26 | CM1.2 14.1,90.03 14.1,82.26 | C14.1 14.1,80.71 14.1,82.26 | 15.43,79.37 C14.1 | C14.1 15.43,72.29 RV1.1
N$22
  Bottom 1.27: R13.1 43.39,59 | 43.39,59 43.39,58.14 C16.2 | D15.C 43.39,59
N$23  (via drill 0.3)  (1 unrouted)
  Top 1.27: T1.4 44.26,64.34 47.6,61 50.97,61
  Bottom 0.254: IC4.13 42.45,64.36 IC4.14 40.4,64.36 | IC4.15 IC4.16
  Bottom 1.27: D15.A 51.41,60.59 v51,61 | 42.45,64.36 40.4,64.36 IC4.16 36.28,64.36
  Bottom 2: 40.3,65.8 38.3,65.8 37.9,66.2 35.6,66.2 35.2,65.8 35.2,64.9 35.76,64.34 T1.4 38.46,64.34 39.1,63.7 42.1,63.7 42.1,65.8 40.3,65.8 | 40.3,65.8 40.3,65.1 40.2,65.2 37,65.2 37,65.07 36.28,64.36
N$24
  Bottom 2: T1.8 59.22,60.62 60.1,61.5 D16.2
N$25  (via drill 0.3, 0.5 pad 1)  (7 unrouted)
  Top 0.508: v57.6,88.7 57.6,81.2 60.2,78.6 60.2,70 62.7,67.5 66.3,67.5 67.76,66.04 C18.1
  Top 0.61: v71,62 v69.5,62 v69.5,60.5 v69.5,59 v69.5,57.5 v68,57.5 v68,59 v68,60.5 v68,62 66.6,62 66.1,61.5 | v66.5,62 v66.5,60.5 v66.5,59 v66.5,57.5
  Top 1: 71.1,62.9 66,62.9 66,56.4 72.9,56.4 72.9,62 | 71.1,62.9 72.9,62.9 72.9,62 | 71.1,62.9 71.1,62 v71,62 | 72.9,62 v72.5,62
  Top 2: C18.1 67.76,63.16 66.1,61.5 61.8,61.5 61.8,57 72,57 72,64.1 71.3,64.8 C18.1 | C18.1 69,63.56 69,58 70.1,59.1 | 70.1,59.1 70.1,63.6 | 70.1,59.1 70.1,58.9 70.6,58.4 | 70.7,58.3 70.6,58.4 | 70.6,58.4 63.3,58.4 62.9,58.8 62.9,60.4 67.5,60.4 67.8,60.1 | 68,59.9 67.8,60.1 | 67.8,60.1 67.8,61.5
  Bottom 0.508: R14.1 57.56,88.66 v57.6,88.7
  Bottom 1: 72.9,62 72.9,56.4 65.9,56.4 65.9,62.9 72.9,62.9 72.9,62 | 70.3,62.4 71,62.4 v71,62 | 72.9,62 v72.5,62
  Bottom 2: D16.3 69.44,59.4 66.2,59.4 | 66.2,59.4 66.2,67.3 71.7,67.3 71.8,67.2 71.8,61.5 71.5,61.2 70.3,62.4 66.8,62.4 66.8,65.9 | 66.8,65.9 67.2,66.3 | 67.2,66.3 68.1,65.4 70.5,65.4 70.5,64 70.2,63.7 68,63.7 68,64.56 C18.1 | L2.1 68.8,67.9 67.2,66.3 | 66.2,59.4 66.2,57.5 66.3,57.4 66.6,57.7 66.9,57.7 | 66.8,65.9 66.2,66.5 66.2,68.2
  other vias: 71,57.5 71,59 71,60.5 72.5,60.5 72.5,59 72.5,57.5
N$26
  Bottom 0.508: OPT2.1 54.07,87.29 R14.2 55.86,85.84 R15.1 58.29,85.82 IC3.2
N$27
  Bottom 0.61: OPT2.2 54.16,84.12 R15.2 55.88,84.08 R16.1
N$28
  Bottom 0.61: R16.2 59.62,82.38 C21.1
N$29
  Bottom 0.61: IC3.1 C21.2 | R18.1 63.83,84.5 R17.2
  Bottom 0.813: IC3.1 63.77,84.44 63.83,84.5
N$30  (via drill 0.3)
  Top 1.016: C25.1 40.03,86.77 42.7,84.1 v42.7,72.61
  Bottom 0.508: IC4.5 44.06,71.64 43.09,72.61 v42.7,72.61 C24.1
  Bottom 1.016: C25.1 36.62,88.13 D19.C 35.21,88.18 R24.1
N$31
  Bottom 1.016: R19.2 35.26,84.43 D19.A
N$32
  Bottom 0.508: R20.1 42.35,80.15 41.81,80.69 D18.A
  Bottom 1.016: T1.1 36.27,79.67 | 36.27,79.67 R19.1 | D18.A 39.94,80.2 39,80.2 38.47,79.67 36.27,79.67
N$33
  Bottom 0.508: R21.1 44.16,78.11 D17.C D18.C
N$34
  Bottom 0.508: IC4.6 45.34,71.77 44.16,72.94 R21.2 R20.2 40.59,74.52 R22.1
N$35
  Bottom 0.61: C23.2 46.58,75.97 R23.1
N$36
  Bottom 1.016: R24.2 40.36,90.44 41.35,89.45 D20.C
OUT_1  (via drill 2 pad 5)
  Top 2.1: REL1.4 20,9.33 | 20,9.33 REL1.5 | v20,4 20,9.33
  Bottom 2.1: REL1.4 20,9.33 | 20,9.33 REL1.5 | v20,4 20,9.33
  pour Top (no thermals): 14,11 26.6,11 26.6,1 14,1
  pour Bottom (no thermals): 14,11 26.6,11 26.6,1 14,1
OUT_2  (via drill 2 pad 5)
  Top 2.1: REL2.4 36.5,9.33 | 36.5,9.33 REL2.5 | v36,4 36,8.83 36.5,9.33
  Bottom 2.1: REL2.4 36,9.33 | 36,9.33 REL2.5 | v36,4 36,9.33
  pour Top (no thermals): 30,11 42.6,11 42.6,1 30,1
  pour Bottom (no thermals): 30,11 42.6,11 42.6,1 30,1
OUT_3  (via drill 2 pad 5)
  Top 2.1: REL3.4 52.5,9.33 | 52.5,9.33 REL3.5 | v52.5,4 52.5,9.33
  Bottom 2.1: REL3.4 52.5,9.33 | 52.5,9.33 REL3.5 | v52.5,4 52.5,9.33
  pour Top (no thermals): 46,11 58.6,11 58.6,1 46,1
  pour Bottom (no thermals): 46,11 58.6,11 58.6,1 46,1
OUT_4  (via drill 2 pad 5)
  Top 2.1: REL4.4 68.5,9.33 | 68.5,9.33 REL4.5 | v68.5,4 68.5,9.33
  Bottom 2.1: REL4.4 69,9.33 | 69,9.33 REL4.5 | v68.5,4 68.5,8.83 69,9.33
  pour Top (no thermals): 62,11 74.6,11 74.6,1 62,1
  pour Bottom (no thermals): 62,11 74.6,11 74.6,1 62,1
OUT_5  (via drill 2 pad 5)
  Top 2.1: REL5.4 84,9.33 | 84,9.33 REL5.5 | v84,4 84,9.33
  Bottom 2.1: REL5.4 84.5,9.33 | 84.5,9.33 REL5.5 | v84,4 84,8.83 84.5,9.33
  pour Top (no thermals): 78,11 90.6,11 90.6,1 78,1
  pour Bottom (no thermals): 78,11 90.6,11 90.6,1 78,1
OUT_6  (via drill 2 pad 5)
  Top 2.1: REL6.4 100,9.33 | 100,9.33 REL6.5 | v100,4 100,9.33
  Bottom 2.1: REL6.4 100,9.33 | 100,9.33 REL6.5 | v100,4 100,9.33
  pour Top (no thermals): 94,11 106.6,11 106.6,1 94,1
  pour Bottom (no thermals): 94,11 106.6,11 106.6,1 94,1
OUT_7  (via drill 2 pad 5)
  Top 2.1: REL7.4 116.5,9.33 | 116.5,9.33 REL7.5 | v116.5,4 116.5,9.33
  Bottom 2.1: REL7.4 116.5,9.33 | 116.5,9.33 REL7.5 | v116.5,4 116.5,9.33
  pour Top (no thermals): 110,11 122.6,11 122.6,1 110,1
  pour Bottom (no thermals): 110,11 122.6,11 122.6,1 110,1
OUT_8  (via drill 2 pad 5)
  Top 2.1: REL8.4 132.5,9.33 | 132.5,9.33 REL8.5 | v132.5,4 132.5,9.33
  Bottom 2.1: REL8.4 132.5,9.33 | 132.5,9.33 REL8.5 | v132.5,4 132.5,9.33
  pour Top (no thermals): 126,11 138.6,11 138.6,1 126,1
  pour Bottom (no thermals): 126,11 138.6,11 138.6,1 126,1
REL_0
  Top 0.254: CON1.12 132.85,47.8 130.6,47.8 127.18,51.22 IC1.1
REL_1
  Top 0.254: CON1.11 130.78,49.02 127.31,52.49 IC1.2
REL_2
  Top 0.254: CON1.10 132.81,50.3 130.8,50.3 127.5,53.6 127.41,53.7 127.34,53.76 IC1.3
REL_3
  Top 0.254: CON1.9 130.94,51.56 127.47,55.03 IC1.4
REL_4
  Top 0.254: CON1.8 132.97,53 130.6,53 127.3,56.3 IC1.5
REL_5
  Top 0.254: CON1.7 130.7,54.1 127.23,57.57 IC1.6
REL_6
  Top 0.254: CON1.6 132.93,55.5 130.2,55.5 126.92,58.77 125.06,58.77 IC1.7
REL_7
  Top 0.254: IC1.8 126.39,60.11 129.86,56.64 CON1.5
RELAY_1
  Top 0.813: R1.2 78.52,50.8 36.5,50.8 29.4,43.7 20.1,43.7 18.09,41.69 D1.A
  Top 1.016: D1.A 18.09,35.84 REL1.1
RELAY_2
  Top 0.813: D2.A 34.52,46.92 37.1,49.5 81.4,49.5 83.14,51.24 R2.2
  Top 1.016: D2.A 34.52,36.28 REL2.1
RELAY_3
  Top 0.813: R3.2 86.03,50.03 84.2,48.2 53.6,48.2 50.45,45.05 50.45,38.1
  Top 1.016: D3.A 50.45,38.1 50.45,36.22 REL3.1
RELAY_4
  Top 0.813: D4.A 66.38,45.48 67.8,46.9 86.7,46.9 88.92,49.12 R4.2
  Top 1.016: D4.A 66.38,36.16 REL4.1
RELAY_5
  Top 0.813: R5.2 91.81,48.41 88.9,45.5 83.9,45.5 82.31,43.91 D5.A
  Top 1.016: D5.A 82.31,36.1 REL5.1
RELAY_6
  Top 0.813: R6.2 94.7,49.1 98.24,45.56 D6.A
  Top 1.016: D6.A 98.24,36.04 REL6.1
RELAY_7
  Top 0.813: R7.2 97.59,49.21 101.6,45.2 111.1,45.2 114.59,41.71 D7.A
  Top 1.016: D7.A 114.59,36.4 REL7.1
RELAY_8
  Top 0.813: R8.2 100.4,48.9 102.3,47 125.9,47 130.02,42.88 D8.A
  Top 1.016: D8.A 130.02,35.84 REL8.1

### Text on the board
tPlace: DO NOT TOUCH | Relay Board REV 1.0 | AC IN | L N | AC IN | L | DO NOT TOUCH | OUT1 | OUT2 | OUT3 | OUT4 | OUT5 | OUT6 | OUT7 | OUT8
tNames: github.com/DvidMakesThings/HW_10-In-Rack_PDU / David Sipos @2025